# Altium schematic sheet royal_esc.SchDoc
size A3
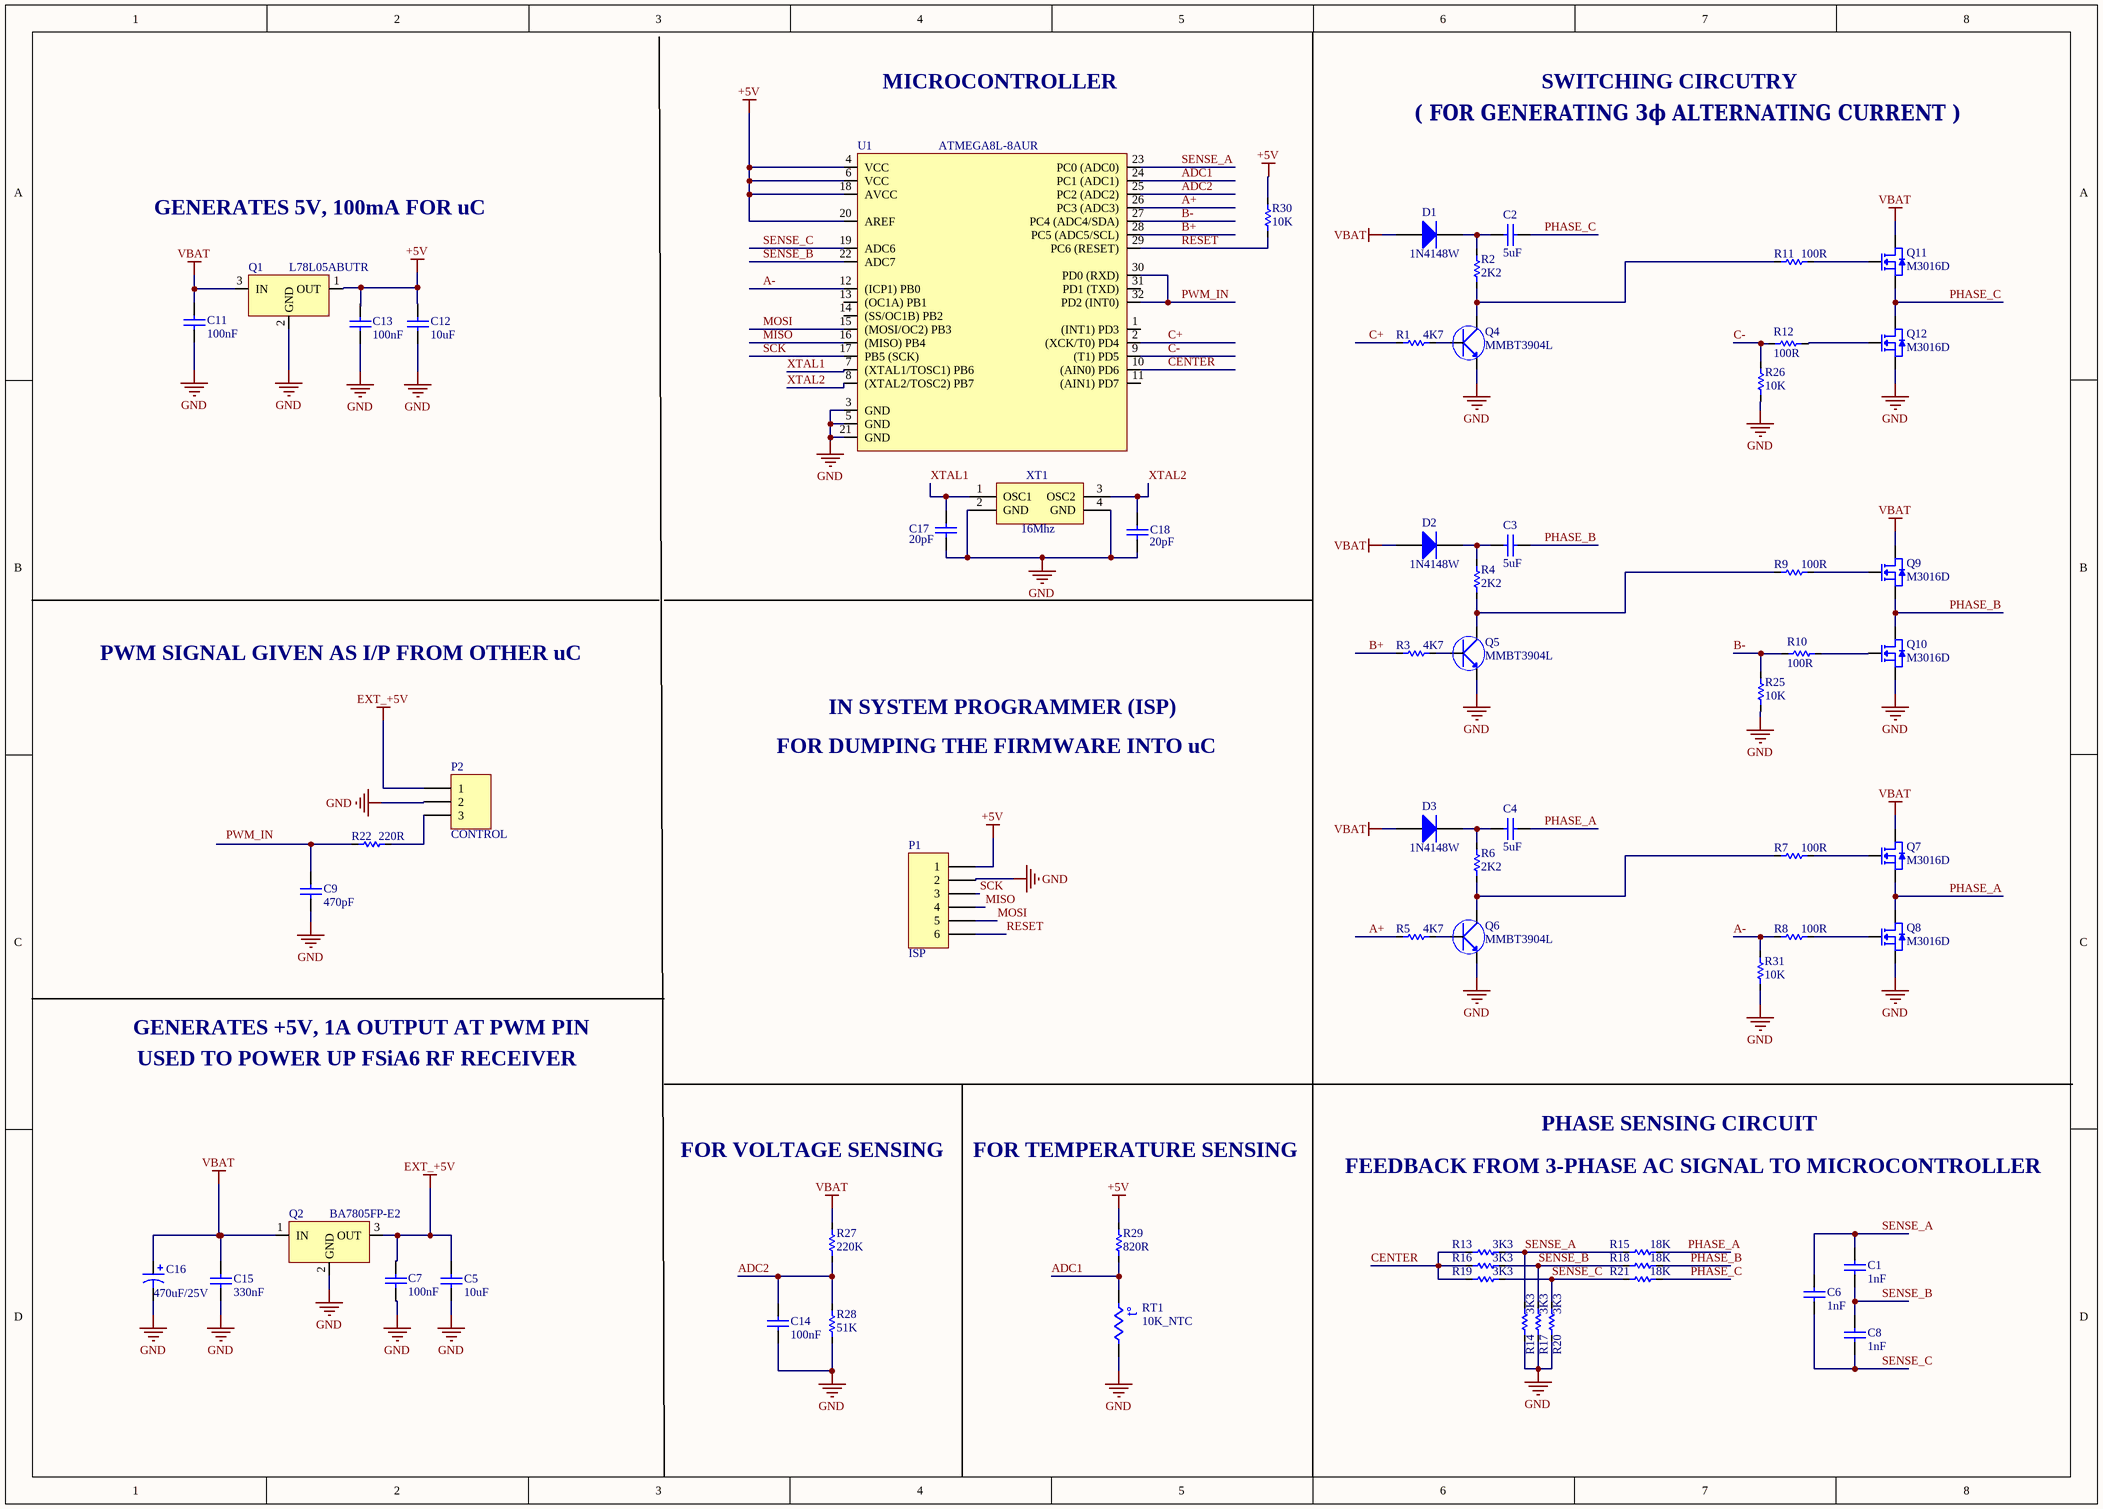
[diagram p0: royal_esc.SchDoc]

## Parts
C1  1nF  [RES_0603]
C2  5uF  [CAP_1206]
C3  5uF  [CAP_1206]
C4  5uF  [CAP_1206]
C5  10uF  [CAP_0805]
C6  1nF  [CAP_1206]
C7  100nF  [RES_0603]
C8  1nF  [RES_0603]
C9  470pF  [RES_0603]
C11  100nF  [RES_0603]
C12  10uF  [CAP_1206]
C13  100nF  [RES_0603]
C14  100nF  [RES_0603]
C15  330nF  [RES_0603]
C16  470uF/25V  [01x01-smd-pad-2.5mmx2mm]
C17  20pF  [RES_0603]
C18  20pF  [RES_0603]
D1  1N4148W  [SOD-123]
D2  1N4148W  [SOD-123]
D3  1N4148W  [SOD-123]
P1  ISP  [01x06-smd-pads-1mm-pitch]
P2  CONTROL  [Pad-smd-01x03-2.54mm-pitch]
Q1  L78L05ABUTR  [SOT89N]
Q2  BA7805FP-E2  [DPAK_118_446_112X59_SMD]
Q4  MMBT3904L  [SOT 23-3]
Q5  MMBT3904L  [SOT 23-3]
Q6  MMBT3904L  [SOT 23-3]
Q7  M3016D  [TO-252_181_255_118X62_SMD]
Q8  M3016D  [TO-252_181_255_118X62_SMD]
Q9  M3016D  [TO-252_181_255_118X62_SMD]
Q10  M3016D  [TO-252_181_255_118X62_SMD]
Q11  M3016D  [TO-252_181_255_118X62_SMD]
Q12  M3016D  [TO-252_181_255_118X62_SMD]
R1  4K7  [RES_0603]
R2  2K2  [RES_0603]
R3  4K7  [RES_0603]
R4  2K2  [RES_0603]
R5  4K7  [RES_0603]
R6  2K2  [RES_0603]
R7  100R  [RES_0603]
R8  100R  [RES_0603]
R9  100R  [RES_0603]
R10  100R  [RES_0603]
R11  100R  [RES_0603]
R12  100R  [RES_0603]
R13  3K3  [RES_0603]
R14  3K3  [RES_0603]
R15  18K  [RES_0603]
R16  3K3  [RES_0603]
R17  3K3  [RES_0603]
R18  18K  [RES_0603]
R19  3K3  [RES_0603]
R20  3K3  [RES_0603]
R21  18K  [RES_0603]
R22  220R  [RES_0603]
R25  10K  [RES_0603]
R26  10K  [RES_0603]
R27  220K  [RES_0603]
R28  51K  [RES_0603]
R29  820R  [RES_0603]
R30  10K  [RES_0603]
R31  10K  [RES_0603]
RT1  10K_NTC  [RES_0805]
U1  ATMEGA8L-8AUR  [TQFP-32]
XT1  16Mhz  [3225_4P_67_157_55x47_SMD]

## Nets
+5V: C12.2 C13.2 P1.1 Q1.1(OUT) R29.2 R30.2 U1.4(VCC) U1.6(VCC) U1.18(AVCC) U1.20(AREF)
EXT_+5V: C5.2 C7.2 P2.1 Q2.3(OUT)
GND: C5.1 C7.1 C9.1 C11.1 C12.1 C13.1 C14.1 C15.1 C16.2 C17.1 C18.1 P1.2 P2.2 Q1.2(GND) Q2.2(GND) Q4.2(E) Q5.2(E) Q6.2(E) Q8.3(S) Q10.3(S) Q12.3(S) R14.1 R17.1 R20.1 R25.1 R26.1 R28.1 R31.2 RT1.2 U1.3(GND) U1.5(GND) U1.21(GND) XT1.2(GND) XT1.4(GND)
VBAT: C11.2 C15.2 C16.1 D1.2(A) D2.2(A) D3.2(A) Q1.3(IN) Q2.1(IN) Q7.2(D) Q9.2(D) Q11.2(D) R27.2
A+: R5.1 U1.26(PC3_(ADC3))
A-: R8.1 R31.1 U1.12((ICP1)_PB0)
ADC1: R29.1 RT1.1 U1.24(PC1_(ADC1))
ADC2: C14.2 R27.1 R28.2 U1.25(PC2_(ADC2))
B+: R3.1 U1.28(PC5_(ADC5/SCL))
B-: R10.2 R25.2 U1.27(PC4_(ADC4/SDA))
C+: R1.1 U1.2((XCK/T0)_PD4)
C-: R12.2 R26.2 U1.9((T1)_PD5)
CENTER: R13.1 R16.1 R19.1 U1.10((AIN0)_PD6)
MISO: P1.4 U1.16((MISO)_PB4)
MOSI: P1.5 U1.15((MOSI/OC2)_PB3)
PHASE_A: C4.1 Q7.3(S) Q8.2(D) R15.1
PHASE_B: C3.1 Q9.3(S) Q10.2(D) R18.1
PHASE_C: C2.1 Q11.3(S) Q12.2(D) R21.1
PWM_IN: U1.30(PD0_(RXD)) U1.32(PD2_(INT0))
RESET: P1.6 R30.1 U1.29(PC6_(RESET))
SCK: P1.3 U1.17(PB5_(SCK))
SENSE_A: C1.1 C6.1 R13.2 R14.2 R15.2 U1.23(PC0_(ADC0))
SENSE_B: C1.2 C8.1 R16.2 R17.2 R18.2 U1.22(ADC7)
SENSE_C: C6.2 C8.2 R19.2 R20.2 R21.2 U1.19(ADC6)
XTAL1: C17.2 U1.7((XTAL1/TOSC1)_PB6) XT1.1(OSC1)
XTAL2: C18.2 U1.8((XTAL2/TOSC2)_PB7) XT1.3(OSC2)
NetC2_2: C2.2 D1.1(K) R2.1
NetC3_2: C3.2 D2.1(K) R4.1
NetC4_2: C4.2 D3.1(K) R6.1
NetC9_2: C9.2 R22.1
NetP2_3: P2.3 R22.2
NetQ4_1: Q4.1(B) R1.2
NetQ4_3: Q4.3(C) R2.2 R11.1
NetQ5_1: Q5.1(B) R3.2
NetQ5_3: Q5.3(C) R4.2 R9.1
NetQ6_1: Q6.1(B) R5.2
NetQ6_3: Q6.3(C) R6.2 R7.1
NetQ7_1: Q7.1(G) R7.2
NetQ8_1: Q8.1(G) R8.2
NetQ9_1: Q9.1(G) R9.2
NetQ10_1: Q10.1(G) R10.1
NetQ11_1: Q11.1(G) R11.2
NetQ12_1: Q12.1(G) R12.1

Not connected (* = marked no-connect by the designer): U1 1((INT1)_PD3) 11((AIN1)_PD7) 13((OC1A)_PB1) 14((SS/OC1B)_PB2) 31(PD1_(TXD))

## Notes on the sheet
- MICROCONTROLLER
- SWITCHING CIRCUTRY
- ( FOR GENERATING 3ϕ ALTERNATING CURRENT )
- GENERATES 5V, 100mA FOR uC
- PWM SIGNAL GIVEN AS I/P FROM OTHER uC
- IN SYSTEM PROGRAMMER (ISP)
- FOR DUMPING THE FIRMWARE INTO uC
- GENERATES +5V, 1A OUTPUT AT PWM PIN
- USED TO POWER UP FSiA6 RF RECEIVER
- FOR VOLTAGE SENSING
- FOR TEMPERATURE SENSING
- FEEDBACK FROM 3-PHASE AC SIGNAL TO MICROCONTROLLER
- PHASE SENSING CIRCUIT
- Labels drawn without touching a wire or pin: PWM_IN
- (in symbol Res Thermal) t°

## Library data of the parts
C1-C9 C11-C15 C17 C18 = Cap: Capacitor
C16 = Cap Pol1: CAP ALUM 470UF 20% 25V RADIAL
D1-D3 = Diode: Default Diode; Published: 8-Jun-2000; LatestRevisionDate: 17-Jul-2002; LatestRevisionNote: Re-released for DXP Platform.; PackageVersion: Sep-1996; PackageReference: SMC; Publisher: Altium Limited; PackageDescription: DO-214-AB/SMC; 2 C-Bend Leads; Body 7.9 x 5.9 mm, inc. leads (LxW); Code_JEDEC: DO-214-AB
P1 = Header 6: Header, 6-Pin; LatestRevisionDate: 17-Jul-2002; LatestRevisionNote: Re-released for DXP Platform.; Publisher: Altium Limited
P2 = Header 3: Header, 3-Pin; LatestRevisionDate: 17-Jul-2002; LatestRevisionNote: Re-released for DXP Platform.; Publisher: Altium Limited
Q1 = 78L05: IC REG LINEAR 5V 100MA SOT89-3
Q2 = 78M05: IC REG LINEAR 5V 500MA DPAK
Q4-Q6 = TRANS: TRANS NPN 40V 0.2A SOT23; Stok Kodu: 265402; Value: BC817; EK1: 45V; EK2: 500mA; Montaj: SMD; Kilif: SOT-23; Marka_1: PHILIPS; ModelNo_1: BC817-40; Marka_2: NXP; Marka_3: On-Semiconductor; ModelNo_3: BC817-40LT1G; DepoStok: 48430.00000; Min_Fiyat: 0.029; Max_Fiyat: 0.100; Ort_Fiyat: 0.052; Ongoru_Fiyat: 0.032; Sinif: TRANS; Tipi: NPN; ModelNo_2: BC817-40; ComponentLink4Description: BC817-40; ComponentLink5Description: BC817-40LT1G
Q7-Q12 = MOSFET-M3016D: N-Ch 30V Fast Switching MOSFETs; Stok Kodu: 266751; Sinif: TRANS; Tipi: N-MOS; Value: DMN10H099SK3-13; EK1: 100V; EK2: 17A; Montaj: SMD; Kilif: D-PAK; Marka_1: DIODES; DepoStok: 44.00000; Min_Fiyat: 1.488; ModelNo_1: DMN10H099SK3-13; ComponentLink3Description: DMN10H099SK3-13; Max_Fiyat: 1.488; Ort_Fiyat: 1.488
R1-R22 R25-R31 = R: Resistor
RT1 = Res Thermal: Thermistor; Published: 24-Mar-1999; LatestRevisionDate: 29-May-2009; LatestRevisionNote: IPC-7351 Footprint Added.; PackageVersion: Mar-2003; PackageReference: 6-0805; Publisher: Altium Limited; PackageDescription: Chip Resistor 0805 Case Size; Code_IPC: RESC2012
U1 = ATMEGA8L: IC MCU 8BIT 8KB FLASH 32TQFP
XT1 = XTAL_12MHZ-X322512MSB4SI: 16MHz ±10ppm 20pF 80Ω SMD-3225_4P SMD Crystal Resonators RoHS /; Manufacturer: CTS; Alternate Part Number-1: NA; Manufacturer Part Number: X322512MSB4SI; Case/Package: SMD; Supplier-1: ARROW; Supplier Part Number-1: X322512MSB4SI